# Altium schematic sheet 电赛原理图.schdoc
size 468 x 370 mm
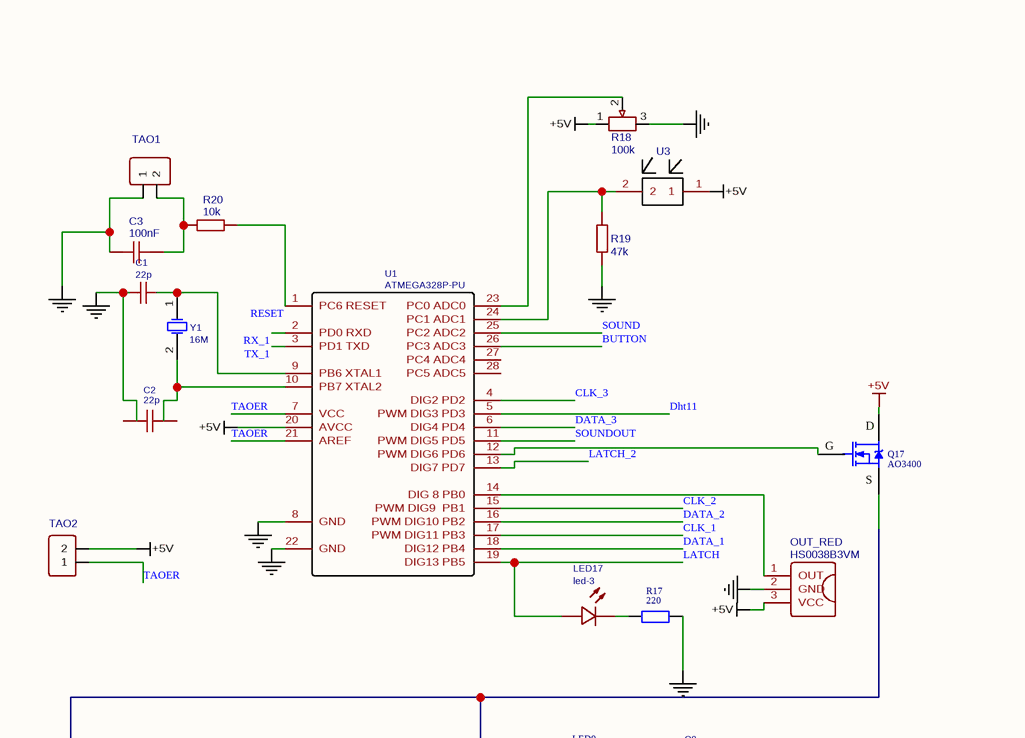
[diagram p0: 电赛原理图.schdoc, top left]
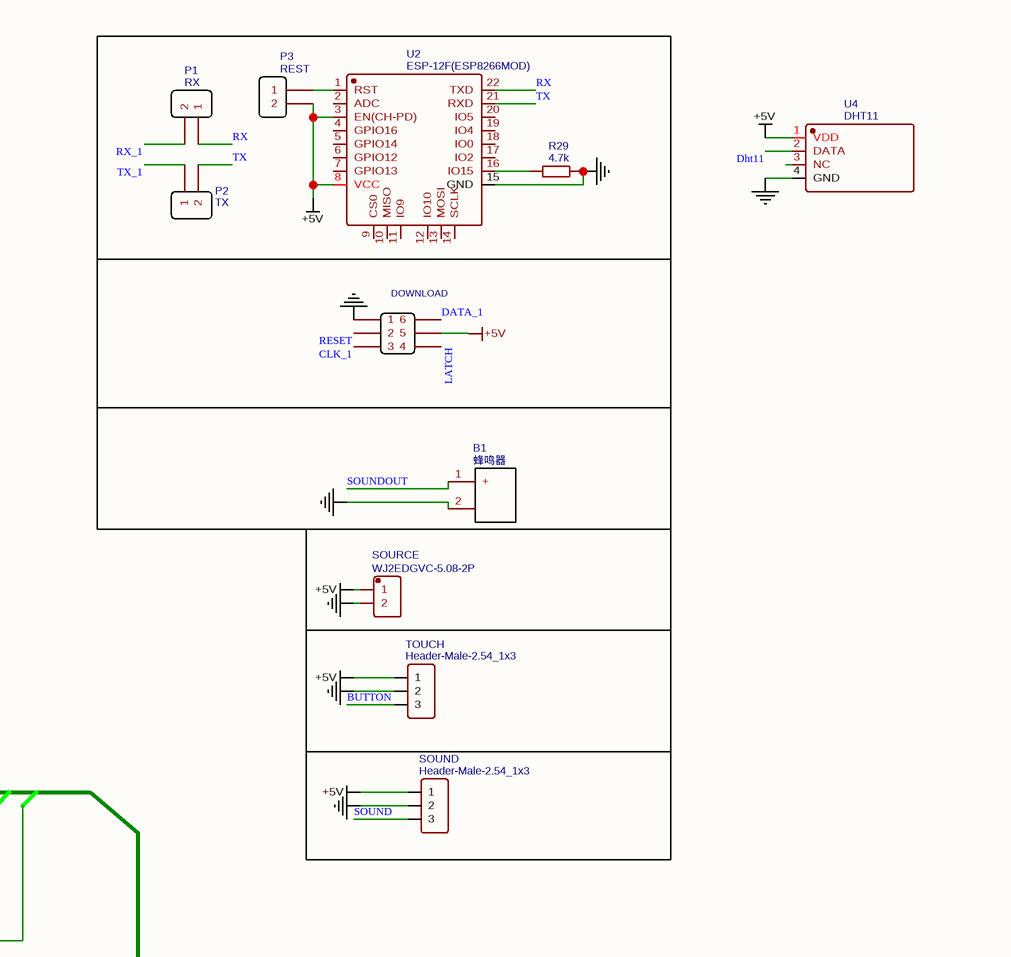
[diagram p1: 电赛原理图.schdoc, top right]
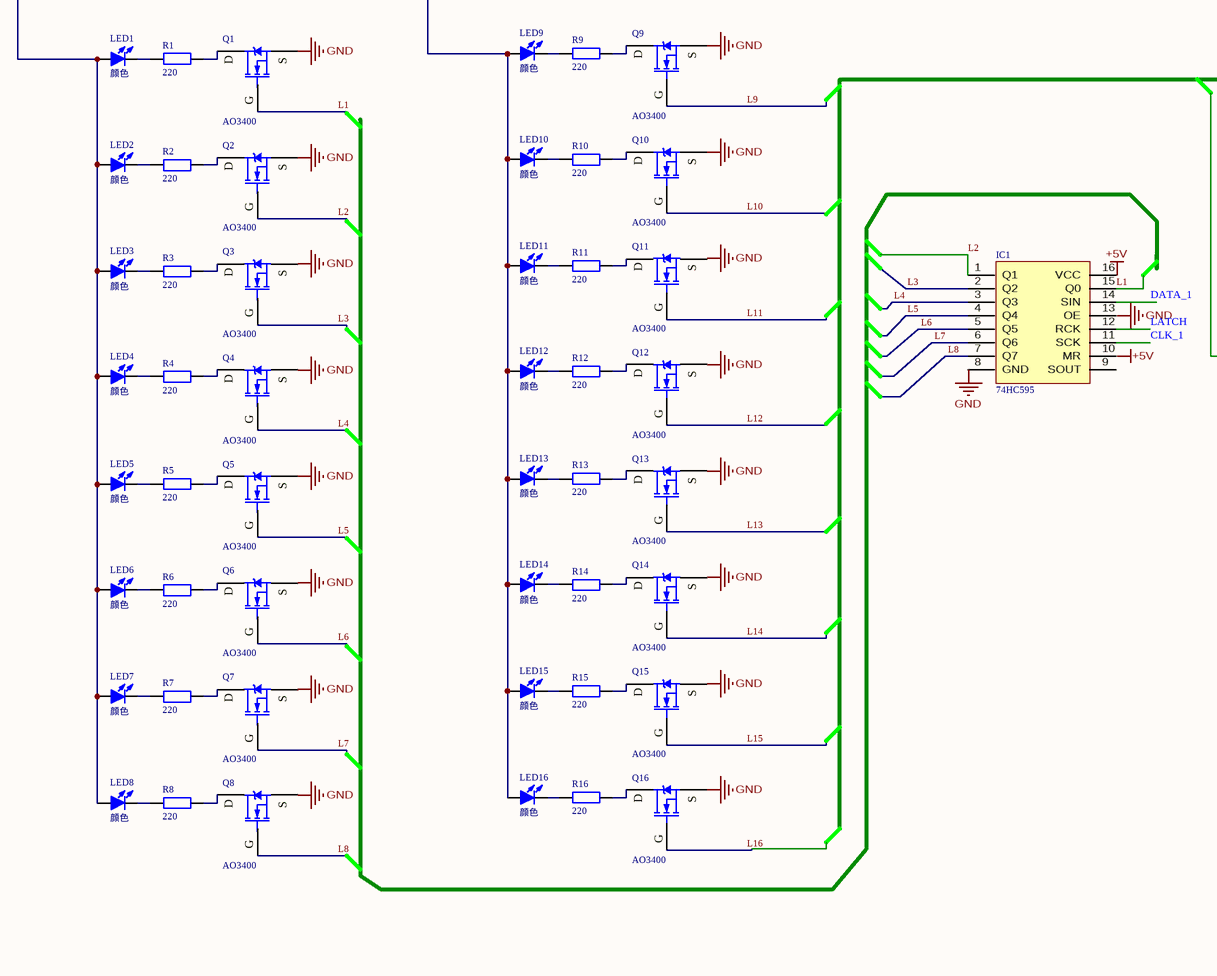
[diagram p2: 电赛原理图.schdoc, bottom left]
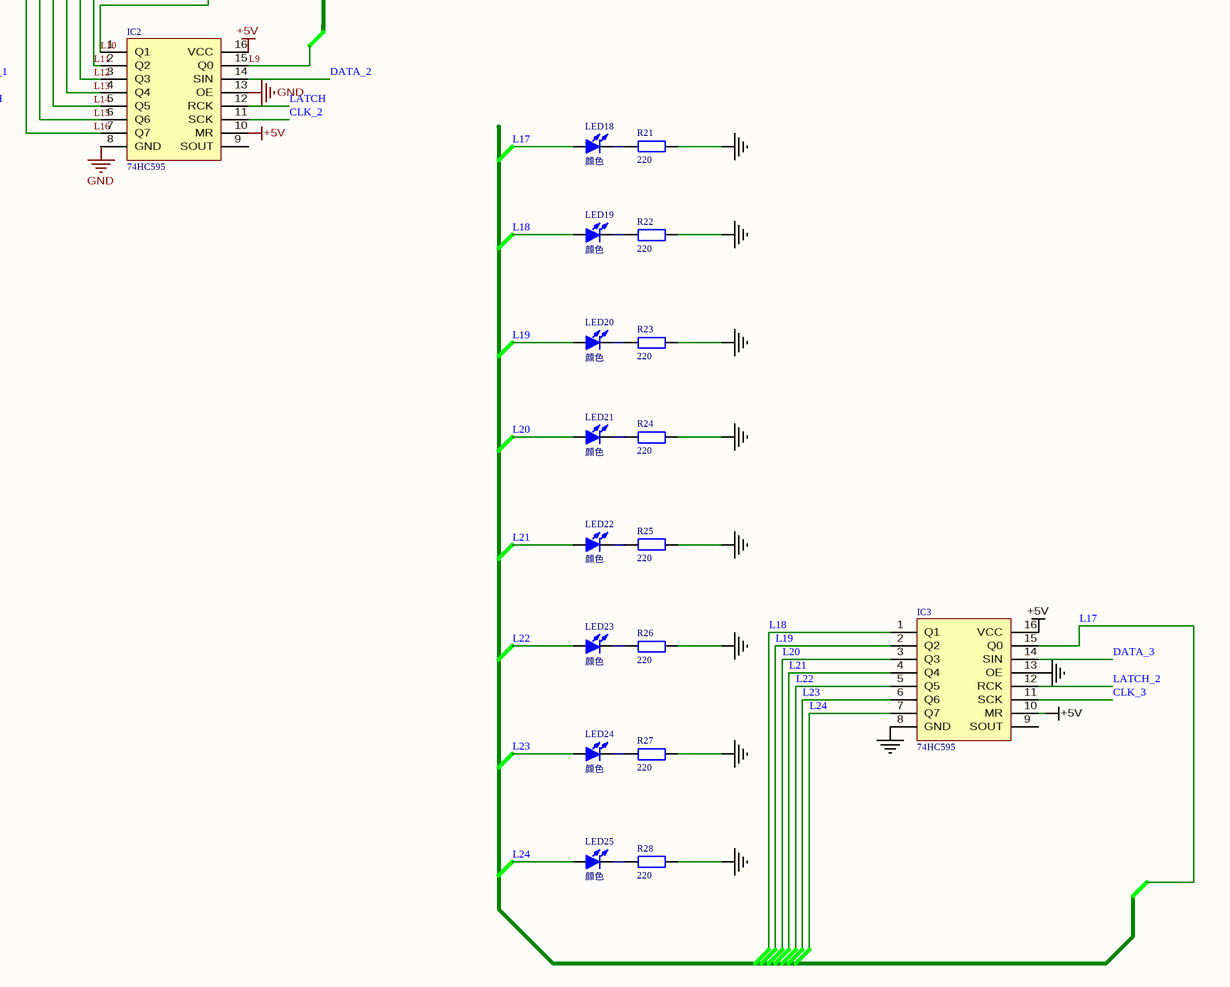
[diagram p3: 电赛原理图.schdoc, bottom right]

## Parts
B1  蜂鸣器  [蜂鸣器]
C1  22p  [0805]
C2  22p  [0805]
C3  100nF  [0805]
DOWNLOAD  M_2.54_2*3P_JX  [DIP-2X3P2.54]  (value not drawn)
IC1  74HC595  [SOP16L]
IC2  74HC595  [SOP16L]
IC3  74HC595  [SOP16L]
LED1  颜色  [1206]
LED2  颜色  [1206]
LED3  颜色  [1206]
LED4  颜色  [1206]
LED5  颜色  [1206]
LED6  颜色  [1206]
LED7  颜色  [1206]
LED8  颜色  [1206]
LED9  颜色  [1206]
LED10  颜色  [1206]
LED11  颜色  [1206]
LED12  颜色  [1206]
LED13  颜色  [1206]
LED14  颜色  [1206]
LED15  颜色  [1206]
LED16  颜色  [1206]
LED17  led-3  [1206]
LED18  颜色  [1206]
LED19  颜色  [1206]
LED20  颜色  [1206]
LED21  颜色  [1206]
LED22  颜色  [1206]
LED23  颜色  [1206]
LED24  颜色  [1206]
LED25  颜色  [1206]
OUT_RED  HS0038B3VM  [HS0038B3VM]
P1  RX  [2.54-1*2P_TIGHT_JX]
P2  TX  [2.54-1*2P_TIGHT_JX]
P3  REST  [2.54-1*2P_TIGHT_JX]
Q1  AO3400  [SOT-23]
Q2  AO3400  [SOT-23]
Q3  AO3400  [SOT-23]
Q4  AO3400  [SOT-23]
Q5  AO3400  [SOT-23]
Q6  AO3400  [SOT-23]
Q7  AO3400  [SOT-23]
Q8  AO3400  [SOT-23]
Q9  AO3400  [SOT-23]
Q10  AO3400  [SOT-23]
Q11  AO3400  [SOT-23]
Q12  AO3400  [SOT-23]
Q13  AO3400  [SOT-23]
Q14  AO3400  [SOT-23]
Q15  AO3400  [SOT-23]
Q16  AO3400  [SOT-23]
Q17  AO3400  [SOT-23]
R1  220  [0805]
R2  220  [0805]
R3  220  [0805]
R4  220  [0805]
R5  220  [0805]
R6  220  [0805]
R7  220  [0805]
R8  220  [0805]
R9  220  [0805]
R10  220  [0805]
R11  220  [0805]
R12  220  [0805]
R13  220  [0805]
R14  220  [0805]
R15  220  [0805]
R16  220  [0805]
R17  220  [0805]
R18  100k  [单联电位器]
R19  47k  [0805]
R20  10k  [0805]
R21  220  [0805]
R22  220  [0805]
R23  220  [0805]
R24  220  [0805]
R25  220  [0805]
R26  220  [0805]
R27  220  [0805]
R28  220  [0805]
R29  4.7k  [0805]
SOUND  Header-Male-2.54_1x3  [HDR-3X1/2.54]
SOURCE  WJ2EDGVC-5.08-2P  [接线端子]
TAO1  Header-Female-2.54_1x2  [HDR-1X2/2.54]  (value not drawn)
TAO2  Header-Female-2.54_1x2  [HDR-1X2/2.54]  (value not drawn)
TOUCH  Header-Male-2.54_1x3  [HDR-3X1/2.54]
U1  ATMEGA328P-PU  [DIP28-300]
U2  ESP-12F(ESP8266MOD)  [ESP-12F(ESP8266MOD)]
U3  光敏电阻  [电阻]  (value not drawn)
U4  DHT11  [DHT11_JX]
Y1  16M  [晶振]

## Nets
+5V: IC2.10(MR) IC2.16(VCC) IC3.10(MR) IC3.16(VCC) OUT_RED.3(VCC) P3.2 R18.1 SOUND.1 SOURCE.1 TAO2.2 TOUCH.1 U1.20(AVCC) U2.3(EN(CH-PD)) U2.8(VCC) U3.1 U4.1(VDD)
GND: B1.2 C1.2 C2.2 DOWNLOAD.1 IC2.13(OE) IC3.8(GND) IC3.13(OE) OUT_RED.2(GND) Q9.2(S) Q10.2(S) Q12.2(S) Q13.2(S) Q14.2(S) Q16.2(S) R17.1 R18.3 R21.2 R22.2 R23.2 R24.2 R25.2 R26.2 R27.2 R28.2 SOUND.2 SOURCE.2 TAO1.1 TOUCH.2 U1.8(GND) U1.22(GND) U2.15(GND) U4.4(GND)
BUTTON: TOUCH.3 U1.26(PC3_ADC3)
CLK_1: DOWNLOAD.3 IC1.11(SCK) U1.17(PWM_DIG11_PB3)
CLK_2: IC2.11(SCK) U1.15(PWM_DIG9__PB1)
CLK_3: IC3.11(SCK) U1.4(DIG2_PD2)
DATA_1: DOWNLOAD.6 IC1.14(SIN) U1.18(DIG12_PB4)
DATA_2: IC2.14(SIN) U1.16(PWM_DIG10_PB2)
DATA_3: IC3.14(SIN) U1.6(DIG4_PD4)
Dht11: U1.5(PWM_DIG3_PD3) U4.2(DATA)
L1: IC1.15(Q0) Q1.1(G)
L2: IC1.1(Q1) Q2.1(G)
L3: IC1.2(Q2) Q3.1(G)
L4: IC1.3(Q3) Q4.1(G)
L5: IC1.4(Q4) Q5.1(G)
L6: IC1.5(Q5) Q6.1(G)
L7: IC1.6(Q6) Q7.1(G)
L8: IC1.7(Q7) Q8.1(G)
L9: IC2.15(Q0) Q9.1(G)
L10: IC2.1(Q1) Q10.1(G)
L11: IC2.2(Q2) Q11.1(G)
L12: IC2.3(Q3) Q12.1(G)
L13: IC2.4(Q4) Q13.1(G)
L14: IC2.5(Q5) Q14.1(G)
L15: IC2.6(Q6) Q15.1(G)
L16: IC2.7(Q7) Q16.1(G)
L17: IC3.15(Q0) LED18.1(A)
L18: IC3.1(Q1) LED19.1(A)
L19: IC3.2(Q2) LED20.1(A)
L20: IC3.3(Q3) LED21.1(A)
L21: IC3.4(Q4) LED22.1(A)
L22: IC3.5(Q5) LED23.1(A)
L23: IC3.6(Q6) LED24.1(A)
L24: IC3.7(Q7) LED25.1(A)
LATCH: DOWNLOAD.4 IC1.12(RCK) IC2.12(RCK) LED17.1(+) U1.19(DIG13_PB5)
LATCH_2: IC3.12(RCK) U1.13(DIG7_PD7)
RESET: DOWNLOAD.2 U1.1(PC6_RESET)
RX: P1.1 U2.22(TXD)
RX_1: P1.2 U1.2(PD0_RXD)
SOUND: SOUND.3 U1.25(PC2_ADC2)
SOUNDOUT: B1.1(+) U1.11(PWM_DIG5_PD5)
TAOER: TAO2.1 U1.7(VCC) U1.21(AREF)
TX: P2.2 U2.21(RXD)
TX_1: P2.1 U1.3(PD1_TXD)
NetC1_1: C1.1 U1.9(PB6_XTAL1) Y1.1(OSC1)
NetC2_1: C2.1 U1.10(PB7_XTAL2) Y1.2(OSC2)
NetLED1_1: LED1.1(A) LED2.1(A) LED3.1(A) LED4.1(A) LED5.1(A) LED6.1(A) LED7.1(A) LED8.1(A) LED9.1(A) LED10.1(A) LED11.1(A) LED12.1(A) LED13.1(A) LED14.1(A) LED15.1(A) LED16.1(A) Q17.2(S)
NetLED1_2: LED1.2(K) R1.1
NetLED2_2: LED2.2(K) R2.1
NetLED3_2: LED3.2(K) R3.1
NetLED4_2: LED4.2(K) R4.1
NetLED5_2: LED5.2(K) R5.1
NetLED6_2: LED6.2(K) R6.1
NetLED7_2: LED7.2(K) R7.1
NetLED8_2: LED8.2(K) R8.1
NetLED9_2: LED9.2(K) R9.1
NetLED10_2: LED10.2(K) R10.1
NetLED11_2: LED11.2(K) R11.1
NetLED12_2: LED12.2(K) R12.1
NetLED13_2: LED13.2(K) R13.1
NetLED14_2: LED14.2(K) R14.1
NetLED15_2: LED15.2(K) R15.1
NetLED16_2: LED16.2(K) R16.1
NetLED17_2: LED17.2(-) R17.2
NetLED18_2: LED18.2(K) R21.1
NetLED19_2: LED19.2(K) R22.1
NetLED20_2: LED20.2(K) R23.1
NetLED21_2: LED21.2(K) R24.1
NetLED22_2: LED22.2(K) R25.1
NetLED23_2: LED23.2(K) R26.1
NetLED24_2: LED24.2(K) R27.1
NetLED25_2: LED25.2(K) R28.1
NetOUT_RED_1: OUT_RED.1(OUT) U1.14(DIG_8_PB0)
NetP3_1: P3.1 U2.1(RST)
NetQ1_3: Q1.3(D) R1.2
NetQ2_3: Q2.3(D) R2.2
NetQ3_3: Q3.3(D) R3.2
NetQ4_3: Q4.3(D) R4.2
NetQ5_3: Q5.3(D) R5.2
NetQ6_3: Q6.3(D) R6.2
NetQ7_3: Q7.3(D) R7.2
NetQ8_3: Q8.3(D) R8.2
NetQ9_3: Q9.3(D) R9.2
NetQ10_3: Q10.3(D) R10.2
NetQ11_3: Q11.3(D) R11.2
NetQ12_3: Q12.3(D) R12.2
NetQ13_3: Q13.3(D) R13.2
NetQ14_3: Q14.3(D) R14.2
NetQ15_3: Q15.3(D) R15.2
NetQ16_3: Q16.3(D) R16.2
NetQ17_1: Q17.1(G) U1.12(PWM_DIG6_PD6)
NetR18_2: R18.2 U1.23(PC0_ADC0)
NetU1_24: U1.24(PC1_ADC1) U3.2

Not connected (* = marked no-connect by the designer): C3 1 2; DOWNLOAD 5; IC1 8(GND) 9(SOUT) 10(MR) 13(OE) 16(VCC); IC2 8(GND) 9(SOUT); IC3 9(SOUT); Q1 2(S); Q2 2(S); Q3 2(S); Q4 2(S); Q5 2(S); Q6 2(S); Q7 2(S); Q8 2(S); Q11 2(S); Q15 2(S); Q17 3(D); R19 1 2; R20 1 2; R29 1 2; TAO1 2; U1 27(PC4_ADC4) 28(PC5_ADC5); U2 2(ADC) 4(GPIO16) 5(GPIO14) 6(GPIO12) 7(GPIO13) 9(CS0) 10(MISO) 11(IO9) 12(IO10) 13(MOSI) 14(SCLK) 16(IO15) 17(IO2) 18(IO0) 19(IO4) 20(IO5); U4 3(NC)

## Notes on the sheet
- Labels drawn without touching a wire or pin: +5V, GND

## Library data of the parts
B1 = 蜂鸣器: Contributor: a446275237; BOM_Manufacturer Part: ?; spicePre: B
C1 C2 = 22p: nameAlias: Value(F); BOM_Manufacturer Part: ?; spicePre: C; spiceSymbolName: Cap_RAD-0.1_US
C3 = 100nF: nameAlias: Value(F); BOM_Manufacturer Part: ?; spicePre: C; spiceSymbolName: Cap_RAD-0.1_US
IC1-IC3 = 74HC595: BOM名称: 8位移位寄存器; 版权归属: 源创客; 学习资源: www.ooocke.com
LED1-LED16 LED18-LED25 = 颜色: BOM名称: 贴片LED; 版权归属: 源创客; 学习资源: www.ooocke.com
LED17 = led-3: BOM_Manufacturer: EVERLIGHT; BOM_Manufacturer Part: 204-10SURD/S530-A3; BOM_Supplier Part: C99772; BOM_Supplier: LCSC; spicePre: L
OUT_RED = HS0038B3VM: BOM_Manufacturer: VISHAY; spicePre: X; BOM_Supplier: LCSC; BOM_Manufacturer Part: HS0038B3VM; BOM_Supplier Part: C5128
Q1-Q17 = AO3400: BOM名称: N沟道场效应管; 版权归属: 源创客; 学习资源: www.ooocke.com
R1-R17 R21-R28 = 220: BOM名称: 贴片电阻; 版权归属: 源创客; 学习资源: www.ooocke.com
R18 = 100k: nameAlias: Resistance(Ohms); Contributor: ZDH233; BOM_Supplier Part: undefined; BOM_Supplier: tocos; BOM_LCSC: C128088; BOM_Manufacturer Part: ?; spicePre: R; spiceSymbolName: 电位器tocos
R19 = 47k: nameAlias: Value(Ω); BOM_Manufacturer Part: ?; spicePre: R; spiceSymbolName: Res_2512(1W)_EU
R20 = 10k: nameAlias: Value(Ω); BOM_Manufacturer Part: ?; spicePre: R; spiceSymbolName: Res_2512(1W)_EU
R29 = 4.7k: nameAlias: Value(Ω); BOM_Manufacturer Part: ?; spicePre: R; spiceSymbolName: Res_AXIAL-0.3(1/8W)_EU
SOUND TOUCH = Header-Male-2.54_1x3: BOM_Manufacturer: BOOMELE; BOM_Manufacturer Part: Header2.54mm 1*3P; BOM_Supplier Part: C49257; BOM_Supplier: LCSC; image: //image.lceda.cn/szlcsc/C49257.jpg; spicePre: P
SOURCE = WJ2EDGVC-5.08-2P: BOM_Manufacturer: ReliaPro; spicePre: X; BOM_Supplier Part: C8445; BOM_Supplier: LCSC; BOM_Manufacturer Part: WJ2EDGVC-5.08-2P; image: //image.lceda.cn/szlcsc/C8445.jpg
TAO1 TAO2 = Header-Female-2.54_1x2: BOM_Manufacturer: BOOMELE; BOM_Manufacturer Part: 2.54-1*2PFemale; BOM_Supplier Part: C49661; BOM_Supplier: LCSC; image: //image.lceda.cn/szlcsc/C49661.jpg; spicePre: P
U1 = ATMEGA328P-PU: BOM_Manufacturer: MICROCHIP; sourceId: Oic6oiASL; Contributor: LCSC; timeStamp: 1451725987; BOM_Supplier: LCSC; BOM_Manufacturer Part: ATMEGA328P-PU; image: //image.lceda.cn/szlcsc/C33901.jpg; BOM_Supplier Part: C33901; spicePre: U
U2 = ESP-12F(ESP8266MOD): BOM_Manufacturer: Ai-Thinker; BOM_Supplier: LCSC; BOM_Manufacturer Part: ESP-12F(ESP8266MOD); BOM_Supplier Part: C82891; spicePre: U
U3 = 光敏电阻: Contributor: 1236210074; sourceId: 9wuQAWUfL; timeStamp: 1461137268; BOM_Manufacturer Part: ?; spicePre: U
U4 = DHT11: BOM_Manufacturer: Aosong (Guangzhou) Elec; Contributor: LCSC; BOM_Supplier: LCSC; BOM_Supplier Part: C117051; BOM_Manufacturer Part: DHT11; spicePre: U
Y1 = 16M: Contributor: AppIe; BOM_Manufacturer Part: ?; spicePre: Y
DOWNLOAD = M_2.54_2*3P_JX: BOM_Supplier Part: C115247; BOM_Supplier: LCSC; BOM_Manufacturer Part: ?; spicePre: P
P1 = RX: BOM_Supplier Part: C115245; BOM_Supplier: LCSC; BOM_Manufacturer Part: ?; spicePre: P
P2 = TX: BOM_Supplier Part: C115245; BOM_Supplier: LCSC; BOM_Manufacturer Part: ?; spicePre: P
P3 = REST: BOM_Supplier Part: C115245; BOM_Supplier: LCSC; BOM_Manufacturer Part: ?; spicePre: P